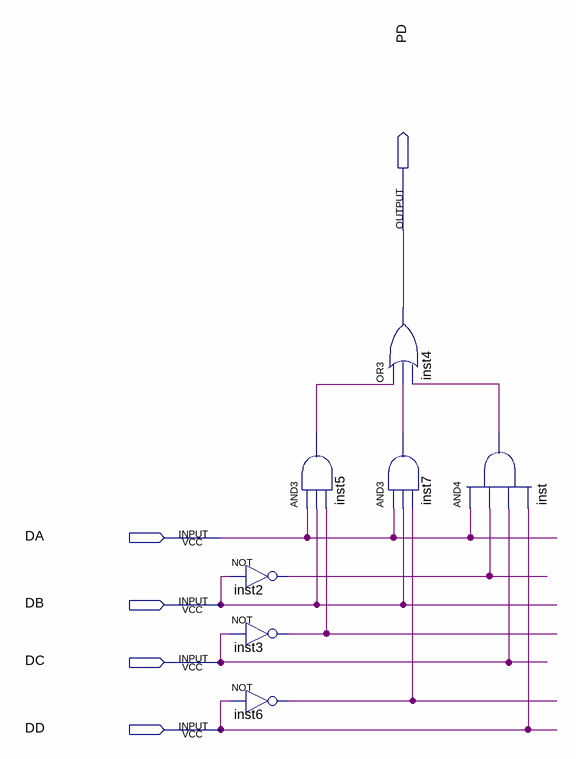
[diagram p0: schematic sheet]
// Quartus schematic ColunaD.bdf as structural Verilog: 7 symbols, 5 pins
module ColunaD (
  input  DA,
  input  DB,
  input  DC,
  input  DD,
  output PD
);

  wire inst2_out, inst3_out, inst5_out, inst6_out, inst7_out, inst_out;

  not inst2 (inst2_out, DB);
  not inst3 (inst3_out, DC);
  not inst6 (inst6_out, DD);
  and inst5 (inst5_out, DA, DB, inst3_out);
  or inst4 (PD, inst5_out, inst7_out, inst_out);
  and inst7 (inst7_out, DA, DB, inst6_out);
  and inst (inst_out, DA, inst2_out, DC, DD);
endmodule
